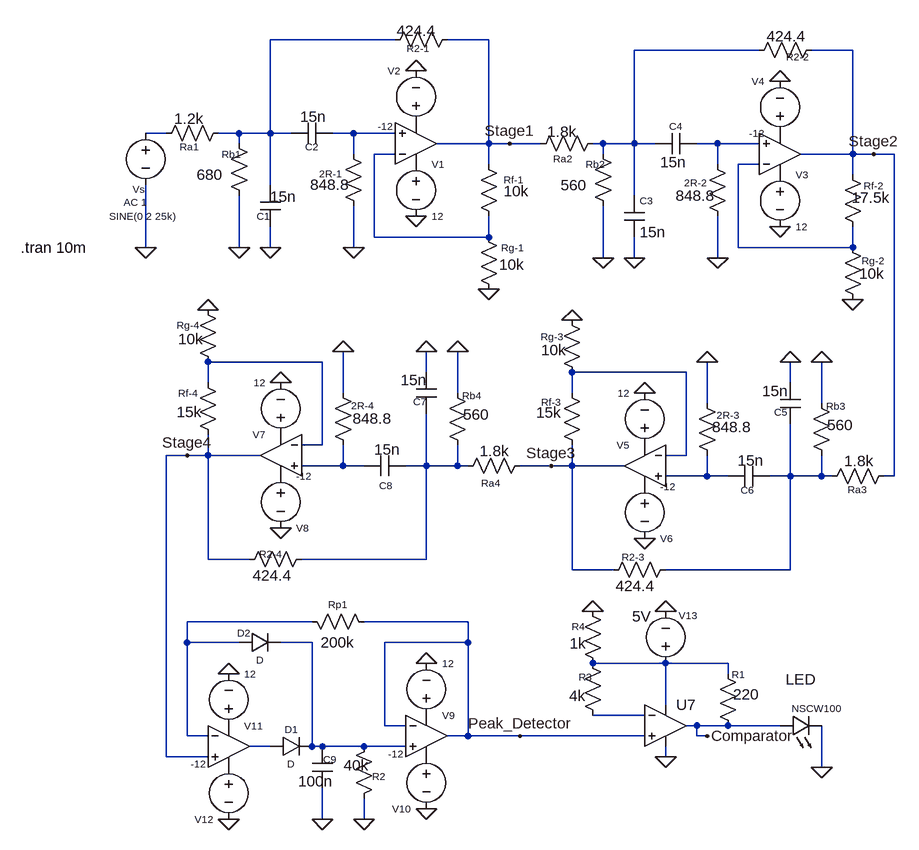
[diagram p0: schematic 8th_order_filter.asc]
8th_order_filter.asc, the LTspice schematic file:
Version 4.1
SHEET 1 2020 1416
WIRE 96 -16 -96 -16
WIRE 240 -16 176 -16
WIRE 656 0 464 0
WIRE 800 0 736 0
WIRE -256 128 -288 128
WIRE -144 128 -176 128
WIRE -96 128 -96 -16
WIRE -96 128 -144 128
WIRE -64 128 -96 128
WIRE 32 128 0 128
WIRE 96 128 32 128
WIRE -144 144 -144 128
WIRE 240 144 240 -16
WIRE 240 144 160 144
WIRE 272 144 240 144
WIRE 320 144 272 144
WIRE 416 144 400 144
WIRE 464 144 464 0
WIRE 464 144 416 144
WIRE 496 144 464 144
WIRE 592 144 560 144
WIRE 656 144 592 144
WIRE 32 160 32 128
WIRE 96 160 64 160
WIRE 416 160 416 144
WIRE 800 160 800 0
WIRE 800 160 720 160
WIRE 832 160 800 160
WIRE 864 160 832 160
WIRE 240 176 240 144
WIRE 592 176 592 144
WIRE 656 176 624 176
WIRE 800 192 800 160
WIRE -96 208 -96 128
WIRE 464 224 464 144
WIRE 64 288 64 160
WIRE 240 288 240 256
WIRE 240 288 64 288
WIRE -288 304 -288 208
WIRE -144 304 -144 224
WIRE -96 304 -96 272
WIRE 32 304 32 240
WIRE 624 304 624 176
WIRE 800 304 800 272
WIRE 800 304 624 304
WIRE 416 320 416 240
WIRE 464 320 464 288
WIRE 592 320 592 256
WIRE -16 480 -192 480
WIRE 144 496 144 464
WIRE 544 496 368 496
WIRE -192 512 -192 480
WIRE 704 512 704 480
WIRE 16 528 16 464
WIRE 192 528 192 464
WIRE 368 528 368 496
WIRE 576 544 576 480
WIRE 752 544 752 480
WIRE -16 608 -16 480
WIRE -16 608 -48 608
WIRE -224 624 -256 624
WIRE -192 624 -192 592
WIRE -192 624 -224 624
WIRE -112 624 -192 624
WIRE 544 624 544 496
WIRE 544 624 512 624
WIRE 16 640 16 608
WIRE 16 640 -48 640
WIRE 48 640 16 640
WIRE 144 640 144 560
WIRE 144 640 112 640
WIRE 192 640 192 608
WIRE 192 640 144 640
WIRE 208 640 192 640
WIRE 336 640 288 640
WIRE 368 640 368 608
WIRE 368 640 336 640
WIRE 448 640 368 640
WIRE 576 656 576 624
WIRE 576 656 512 656
WIRE 608 656 576 656
WIRE 704 656 704 576
WIRE 704 656 672 656
WIRE 752 656 752 624
WIRE 752 656 704 656
WIRE 768 656 752 656
WIRE 864 656 864 160
WIRE 864 656 848 656
WIRE -192 784 -192 624
WIRE -128 784 -192 784
WIRE 144 784 144 640
WIRE 144 784 -48 784
WIRE 368 800 368 640
WIRE 432 800 368 800
WIRE 704 800 704 656
WIRE 704 800 512 800
WIRE -32 880 -224 880
WIRE 208 880 48 880
WIRE -224 912 -224 880
WIRE -144 912 -224 912
WIRE -32 912 -80 912
WIRE 208 912 208 880
WIRE 208 912 80 912
WIRE 512 944 400 944
WIRE 608 944 512 944
WIRE 608 960 608 944
WIRE 512 1008 512 944
WIRE 480 1024 400 1024
WIRE 80 1040 80 912
WIRE 112 1040 80 1040
WIRE 560 1040 544 1040
WIRE 608 1040 560 1040
WIRE 688 1040 608 1040
WIRE -224 1056 -224 912
WIRE -192 1056 -224 1056
WIRE 208 1056 208 912
WIRE 208 1056 176 1056
WIRE 288 1056 208 1056
WIRE 480 1056 288 1056
WIRE 560 1056 560 1040
WIRE 576 1056 560 1056
WIRE -96 1072 -128 1072
WIRE -32 1072 -32 912
WIRE -16 1072 -32 1072
WIRE 48 1072 -16 1072
WIRE 112 1072 48 1072
WIRE -256 1088 -256 624
WIRE -192 1088 -256 1088
WIRE 512 1088 512 1072
WIRE 752 1104 752 1040
WIRE -16 1184 -16 1136
WIRE 48 1184 48 1152
FLAG -96 304 0
FLAG 32 304 0
FLAG -288 304 0
FLAG 272 144 Stage1
FLAG 128 256 0
FLAG 128 32 0
FLAG 464 320 0
FLAG 592 320 0
FLAG 832 160 Stage2
FLAG 688 272 0
FLAG 688 48 0
FLAG 704 480 0
FLAG 576 480 0
FLAG 336 640 Stage3
FLAG 480 528 0
FLAG 480 752 0
FLAG 144 464 0
FLAG 16 464 0
FLAG -224 624 Stage4
FLAG -80 512 0
FLAG -80 736 0
FLAG 416 320 0
FLAG 752 480 0
FLAG 192 464 0
FLAG -144 304 0
FLAG 288 1056 Peak_Detector
FLAG 144 944 0
FLAG 144 1168 0
FLAG -160 960 0
FLAG -160 1184 0
FLAG -16 1184 0
FLAG 48 1184 0
FLAG 512 864 0
FLAG 512 1088 0
FLAG 400 864 0
FLAG 576 1056 Comparator
FLAG 752 1104 0
FLAG 240 368 0
FLAG 800 384 0
FLAG 368 416 0
FLAG -192 400 0
SYMBOL OpAmps\\UniversalOpAmp2 128 144 M180
WINDOW 0 16 -32 Invisible 1
SYMATTR InstName U1
SYMBOL res 192 -32 R90
WINDOW 0 40 61 VBottom 1
WINDOW 3 -13 63 VTop 2
SYMATTR InstName R2-1
SYMATTR Value 424.4
SYMBOL res -160 112 R90
WINDOW 0 47 61 VBottom 1
WINDOW 3 -22 61 VTop 2
SYMATTR InstName Ra1
SYMATTR Value 1.2k
SYMBOL res 48 256 R180
WINDOW 0 34 66 Left 1
WINDOW 3 22 49 Left 2
SYMATTR InstName 2R-1
SYMATTR Value 848.8
SYMBOL res 256 272 R180
WINDOW 0 -22 62 Top 1
WINDOW 3 -46 55 Left 2
SYMATTR InstName Rf-1
SYMATTR Value 10k
SYMBOL res 224 272 R0
WINDOW 0 35 32 Left 1
WINDOW 3 32 58 Left 2
SYMATTR InstName Rg-1
SYMATTR Value 10k
SYMBOL cap -112 208 R0
WINDOW 0 -5 48 Left 1
WINDOW 3 16 18 Left 2
SYMATTR InstName C1
SYMATTR Value 15n
SYMBOL cap 0 112 R90
WINDOW 0 47 32 VBottom 1
WINDOW 3 -25 30 VTop 2
SYMATTR InstName C2
SYMATTR Value 15n
SYMBOL voltage -288 112 R0
WINDOW 0 -20 102 Left 1
WINDOW 123 -34 122 Left 1
WINDOW 39 0 0 Left 0
WINDOW 3 -56 144 Left 1
SYMATTR InstName Vs
SYMATTR Value2 AC 1
SYMATTR Value SINE(0 2 25k)
SYMBOL voltage 128 160 R0
WINDOW 0 24 16 Left 1
WINDOW 3 24 96 Left 1
WINDOW 123 0 0 Left 0
WINDOW 39 0 0 Left 0
SYMATTR InstName V1
SYMATTR Value 12
SYMBOL voltage 128 128 R180
WINDOW 0 24 96 Left 1
WINDOW 3 35 11 Left 1
WINDOW 123 0 0 Left 0
WINDOW 39 0 0 Left 0
SYMATTR InstName V2
SYMATTR Value -12
SYMBOL OpAmps\\UniversalOpAmp2 688 160 M180
WINDOW 0 16 -32 Invisible 1
SYMATTR InstName U2
SYMBOL res 752 -16 R90
WINDOW 0 37 37 VBottom 1
WINDOW 3 -21 54 VTop 2
SYMATTR InstName R2-2
SYMATTR Value 424.4
SYMBOL res 416 128 R90
WINDOW 0 50 62 VBottom 1
WINDOW 3 -18 63 VTop 2
SYMATTR InstName Ra2
SYMATTR Value 1.8k
SYMBOL res 608 272 R180
WINDOW 0 32 68 Left 1
WINDOW 3 20 48 Left 2
SYMATTR InstName 2R-2
SYMATTR Value 848.8
SYMBOL res 816 288 R180
WINDOW 0 -1 79 Right 1
WINDOW 3 -42 61 Left 2
SYMATTR InstName Rf-2
SYMATTR Value 17.5k
SYMBOL res 784 288 R0
WINDOW 0 30 36 Left 1
WINDOW 3 26 56 Left 2
SYMATTR InstName Rg-2
SYMATTR Value 10k
SYMBOL cap 448 224 R0
WINDOW 0 24 8 Left 1
SYMATTR InstName C3
SYMATTR Value 15n
SYMBOL cap 560 128 R90
WINDOW 0 0 32 VBottom 1
WINDOW 3 29 36 VTop 2
SYMATTR InstName C4
SYMATTR Value 15n
SYMBOL voltage 688 176 R0
WINDOW 0 24 16 Left 1
WINDOW 3 24 96 Left 1
WINDOW 123 0 0 Left 0
WINDOW 39 0 0 Left 0
SYMATTR InstName V3
SYMATTR Value 12
SYMBOL voltage 688 144 R180
WINDOW 0 24 96 Left 1
WINDOW 3 24 16 Left 1
WINDOW 123 0 0 Left 0
WINDOW 39 0 0 Left 0
SYMATTR InstName V4
SYMATTR Value -12
SYMBOL OpAmps\\UniversalOpAmp2 480 640 M0
WINDOW 0 16 -32 Invisible 1
SYMATTR InstName U3
SYMBOL res 416 816 R270
WINDOW 0 25 46 VTop 1
WINDOW 3 7 50 VBottom 2
SYMATTR InstName R2-3
SYMATTR Value 424.4
SYMBOL res 752 672 R270
WINDOW 0 -15 55 VTop 1
WINDOW 3 55 58 VBottom 2
SYMATTR InstName Ra3
SYMATTR Value 1.8k
SYMBOL res 560 528 R0
WINDOW 0 31 34 Left 1
WINDOW 3 24 52 Left 2
SYMATTR InstName 2R-3
SYMATTR Value 848.8
SYMBOL res 352 512 R0
WINDOW 0 -31 30 Left 1
WINDOW 3 -39 46 Left 2
SYMATTR InstName Rf-3
SYMATTR Value 15k
SYMBOL res 384 512 R180
WINDOW 0 29 71 Left 1
WINDOW 3 24 50 Left 2
SYMATTR InstName Rg-3
SYMATTR Value 10k
SYMBOL cap 720 576 R180
WINDOW 0 20 19 Left 1
WINDOW 3 19 51 Left 2
SYMATTR InstName C5
SYMATTR Value 15n
SYMBOL cap 608 672 R270
WINDOW 0 -16 30 VTop 1
WINDOW 3 56 35 VBottom 2
SYMATTR InstName C6
SYMATTR Value 15n
SYMBOL voltage 480 624 R180
WINDOW 0 24 16 Left 1
WINDOW 3 24 96 Left 1
WINDOW 123 0 0 Left 0
WINDOW 39 0 0 Left 0
SYMATTR InstName V5
SYMATTR Value 12
SYMBOL voltage 480 656 R0
WINDOW 0 24 96 Left 1
WINDOW 3 24 16 Left 1
WINDOW 123 0 0 Left 0
WINDOW 39 0 0 Left 0
SYMATTR InstName V6
SYMATTR Value -12
SYMBOL OpAmps\\UniversalOpAmp2 -80 624 M0
WINDOW 0 16 -32 Invisible 1
SYMATTR InstName U4
SYMBOL res -144 800 R270
WINDOW 0 14 48 VTop 1
WINDOW 3 7 51 VBottom 2
SYMATTR InstName R2-4
SYMATTR Value 424.4
SYMBOL res 192 656 R270
WINDOW 0 -21 51 VTop 1
WINDOW 3 54 57 VBottom 2
SYMATTR InstName Ra4
SYMATTR Value 1.8k
SYMBOL res 0 512 R0
WINDOW 0 28 35 Left 1
WINDOW 3 31 55 Left 2
SYMATTR InstName 2R-4
SYMATTR Value 848.8
SYMBOL res -208 496 R0
WINDOW 0 -30 32 Left 1
WINDOW 3 -32 61 Left 2
SYMATTR InstName Rf-4
SYMATTR Value 15k
SYMBOL res -176 496 R180
WINDOW 0 29 73 Left 1
WINDOW 3 23 51 Left 2
SYMATTR InstName Rg-4
SYMATTR Value 10k
SYMBOL cap 160 560 R180
WINDOW 0 16 19 Left 1
WINDOW 3 15 52 Left 2
SYMATTR InstName C7
SYMATTR Value 15n
SYMBOL cap 48 656 R270
WINDOW 0 -25 34 VTop 1
WINDOW 3 57 36 VBottom 2
SYMATTR InstName C8
SYMATTR Value 15n
SYMBOL voltage -80 608 R180
WINDOW 0 24 16 Left 1
WINDOW 3 24 96 Left 1
WINDOW 123 0 0 Left 0
WINDOW 39 0 0 Left 0
SYMATTR InstName V7
SYMATTR Value 12
SYMBOL voltage -80 640 R0
WINDOW 0 24 96 Left 1
WINDOW 3 24 16 Left 1
WINDOW 123 0 0 Left 0
WINDOW 39 0 0 Left 0
SYMATTR InstName V8
SYMATTR Value -12
SYMBOL res 400 144 R0
WINDOW 0 -11 32 Left 1
WINDOW 3 -49 64 Left 2
SYMATTR InstName Rb2
SYMATTR Value 560
SYMBOL res 736 528 R0
WINDOW 0 23 20 Left 1
WINDOW 3 25 49 Left 2
SYMATTR InstName Rb3
SYMATTR Value 560
SYMBOL res 176 512 R0
WINDOW 0 23 20 Left 1
WINDOW 3 25 49 Left 2
SYMATTR InstName Rb4
SYMATTR Value 560
SYMBOL res -160 128 R0
WINDOW 0 -11 32 Left 1
WINDOW 3 -49 64 Left 2
SYMATTR InstName Rb1
SYMATTR Value 680
SYMBOL OpAmps\\UniversalOpAmp2 144 1056 R0
WINDOW 0 16 -32 Invisible 1
SYMATTR InstName U5
SYMBOL res 64 896 M270
WINDOW 0 32 56 VTop 1
WINDOW 3 0 56 VBottom 2
SYMATTR InstName Rp1
SYMATTR Value 200k
SYMBOL res 64 1056 M0
WINDOW 0 -17 62 Left 1
WINDOW 3 8 45 Left 2
SYMATTR InstName R2
SYMATTR Value 40k
SYMBOL cap -32 1136 M180
WINDOW 0 17 44 Left 1
WINDOW 3 -21 10 Left 2
SYMATTR InstName C9
SYMATTR Value 100n
SYMBOL voltage 144 1040 M180
WINDOW 0 24 16 Left 1
WINDOW 3 24 96 Left 1
WINDOW 123 0 0 Left 0
WINDOW 39 0 0 Left 0
SYMATTR InstName V9
SYMATTR Value 12
SYMBOL voltage 144 1072 M0
WINDOW 0 24 96 Left 1
WINDOW 3 35 11 Left 1
WINDOW 123 0 0 Left 0
WINDOW 39 0 0 Left 0
SYMATTR InstName V10
SYMATTR Value -12
SYMBOL OpAmps\\UniversalOpAmp2 -160 1072 R0
WINDOW 0 16 -32 Invisible 1
SYMATTR InstName U6
SYMBOL voltage -160 1056 M180
WINDOW 0 24 16 Left 1
WINDOW 3 24 96 Left 1
WINDOW 123 0 0 Left 0
WINDOW 39 0 0 Left 0
SYMATTR InstName V11
SYMATTR Value 12
SYMBOL voltage -160 1088 M0
WINDOW 0 24 96 Left 1
WINDOW 3 35 11 Left 1
WINDOW 123 0 0 Left 0
WINDOW 39 0 0 Left 0
SYMATTR InstName V12
SYMATTR Value -12
SYMBOL diode -96 1088 R270
WINDOW 0 32 32 VTop 1
WINDOW 3 0 32 VBottom 1
SYMATTR InstName D1
SYMBOL diode -144 928 R270
WINDOW 0 20 7 VTop 1
WINDOW 3 0 32 VBottom 1
SYMATTR InstName D2
SYMBOL OpAmps\\UniversalOpAmp2 512 1040 R0
SYMATTR InstName U7
SYMBOL voltage 512 960 R180
WINDOW 0 -49 90 Left 1
WINDOW 3 22 88 Left 2
WINDOW 123 0 0 Left 0
WINDOW 39 0 0 Left 0
SYMATTR InstName V13
SYMATTR Value 5V
SYMBOL res 592 944 R0
WINDOW 0 22 17 Left 1
WINDOW 3 24 48 Left 2
SYMATTR InstName R1
SYMATTR Value 220
SYMBOL res 384 928 R0
WINDOW 0 -6 37 Left 1
WINDOW 3 -20 66 Left 2
SYMATTR InstName R3
SYMATTR Value 4k
SYMBOL res 416 960 R180
WINDOW 0 28 73 Left 1
WINDOW 3 26 47 Left 2
SYMATTR InstName R4
SYMATTR Value 1k
SYMBOL LED 688 1056 R270
WINDOW 0 72 32 VTop 2
WINDOW 3 53 56 VBottom 1
SYMATTR InstName LED
SYMATTR Value NSCW100
TEXT -480 304 Left 2 !.tran 10m

The netlist it stands for:
* 8th_order_filter.asc
X§U1 N004 N006 P001 P002 Stage1 level2 Avol=1Meg GBW=10Meg Slew=10Meg Ilimit=25m Rail=0 Vos=0 En=0 Enk=0 In=0 Ink=0 Rin=500Meg  ; pins In+ In- V+ V- OUT
R2-1 Stage1 N001 424.4
Ra1 N001 N003 1.2k
R§2R-1 0 N004 848.8
Rf-1 N006 Stage1 10k
Rg-1 N006 0 10k
C1 N001 0 15n
C2 N004 N001 15n
Vs N003 0 SINE(0 2 25k) AC 1
V1 P001 0 12
V2 P002 0 -12
X§U2 N005 N007 P003 P004 Stage2 level2 Avol=1Meg GBW=10Meg Slew=10Meg Ilimit=25m Rail=0 Vos=0 En=0 Enk=0 In=0 Ink=0 Rin=500Meg  ; pins In+ In- V+ V- OUT
R2-2 Stage2 N002 424.4
Ra2 N002 Stage1 1.8k
R§2R-2 0 N005 848.8
Rf-2 N007 Stage2 17.5k
Rg-2 N007 0 10k
C3 N002 0 15n
C4 N005 N002 15n
V3 P003 0 12
V4 P004 0 -12
X§U3 N012 N009 P005 P006 Stage3 level2 Avol=1Meg GBW=10Meg Slew=10Meg Ilimit=25m Rail=0 Vos=0 En=0 Enk=0 In=0 Ink=0 Rin=500Meg  ; pins In+ In- V+ V- OUT
R2-3 Stage3 N013 424.4
Ra3 N013 Stage2 1.8k
R§2R-3 0 N012 848.8
Rf-3 N009 Stage3 15k
Rg-3 N009 0 10k
C5 N013 0 15n
C6 N012 N013 15n
V5 P005 0 12
V6 P006 0 -12
X§U4 N010 N008 P007 P008 Stage4 level2 Avol=1Meg GBW=10Meg Slew=10Meg Ilimit=25m Rail=0 Vos=0 En=0 Enk=0 In=0 Ink=0 Rin=500Meg  ; pins In+ In- V+ V- OUT
R2-4 Stage4 N011 424.4
Ra4 N011 Stage3 1.8k
R§2R-4 0 N010 848.8
Rf-4 N008 Stage4 15k
Rg-4 N008 0 10k
C7 N011 0 15n
C8 N010 N011 15n
V7 P007 0 12
V8 P008 0 -12
Rb2 N002 0 560
Rb3 0 N013 560
Rb4 0 N011 560
Rb1 N001 0 680
X§U5 N015 Peak_Detector P009 P010 Peak_Detector level2 Avol=1Meg GBW=10Meg Slew=10Meg Ilimit=25m Rail=0 Vos=0 En=0 Enk=0 In=0 Ink=0 Rin=500Meg  ; pins In+ In- V+ V- OUT
Rp1 Peak_Detector N014 200k
R2 N015 0 40k
C9 0 N015 100n
V9 P009 0 12
V10 P010 0 -12
X§U6 Stage4 N014 P011 P012 N018 level2 Avol=1Meg GBW=10Meg Slew=10Meg Ilimit=25m Rail=0 Vos=0 En=0 Enk=0 In=0 Ink=0 Rin=500Meg  ; pins In+ In- V+ V- OUT
V11 P011 0 12
V12 P012 0 -12
D1 N018 N015 D
D2 N014 N015 D
X§U7 Peak_Detector N017 N016 0 Comparator level2 Avol=1Meg GBW=10Meg Slew=10Meg Ilimit=25m Rail=0 Vos=0 En=0 Enk=0 In=0 Ink=0 Rin=500Meg  ; pins In+ In- V+ V- OUT
V13 N016 0 5V
R1 N016 Comparator 220
R3 N016 N017 4k
R4 N016 0 1k
D§LED Comparator 0 NSCW100
.model D D
.lib standard.dio
.tran 10m
.lib UniversalOpAmp2.lib
.backanno
.end